# EAGLE design HIJACK_C (EAGLE 5.10)
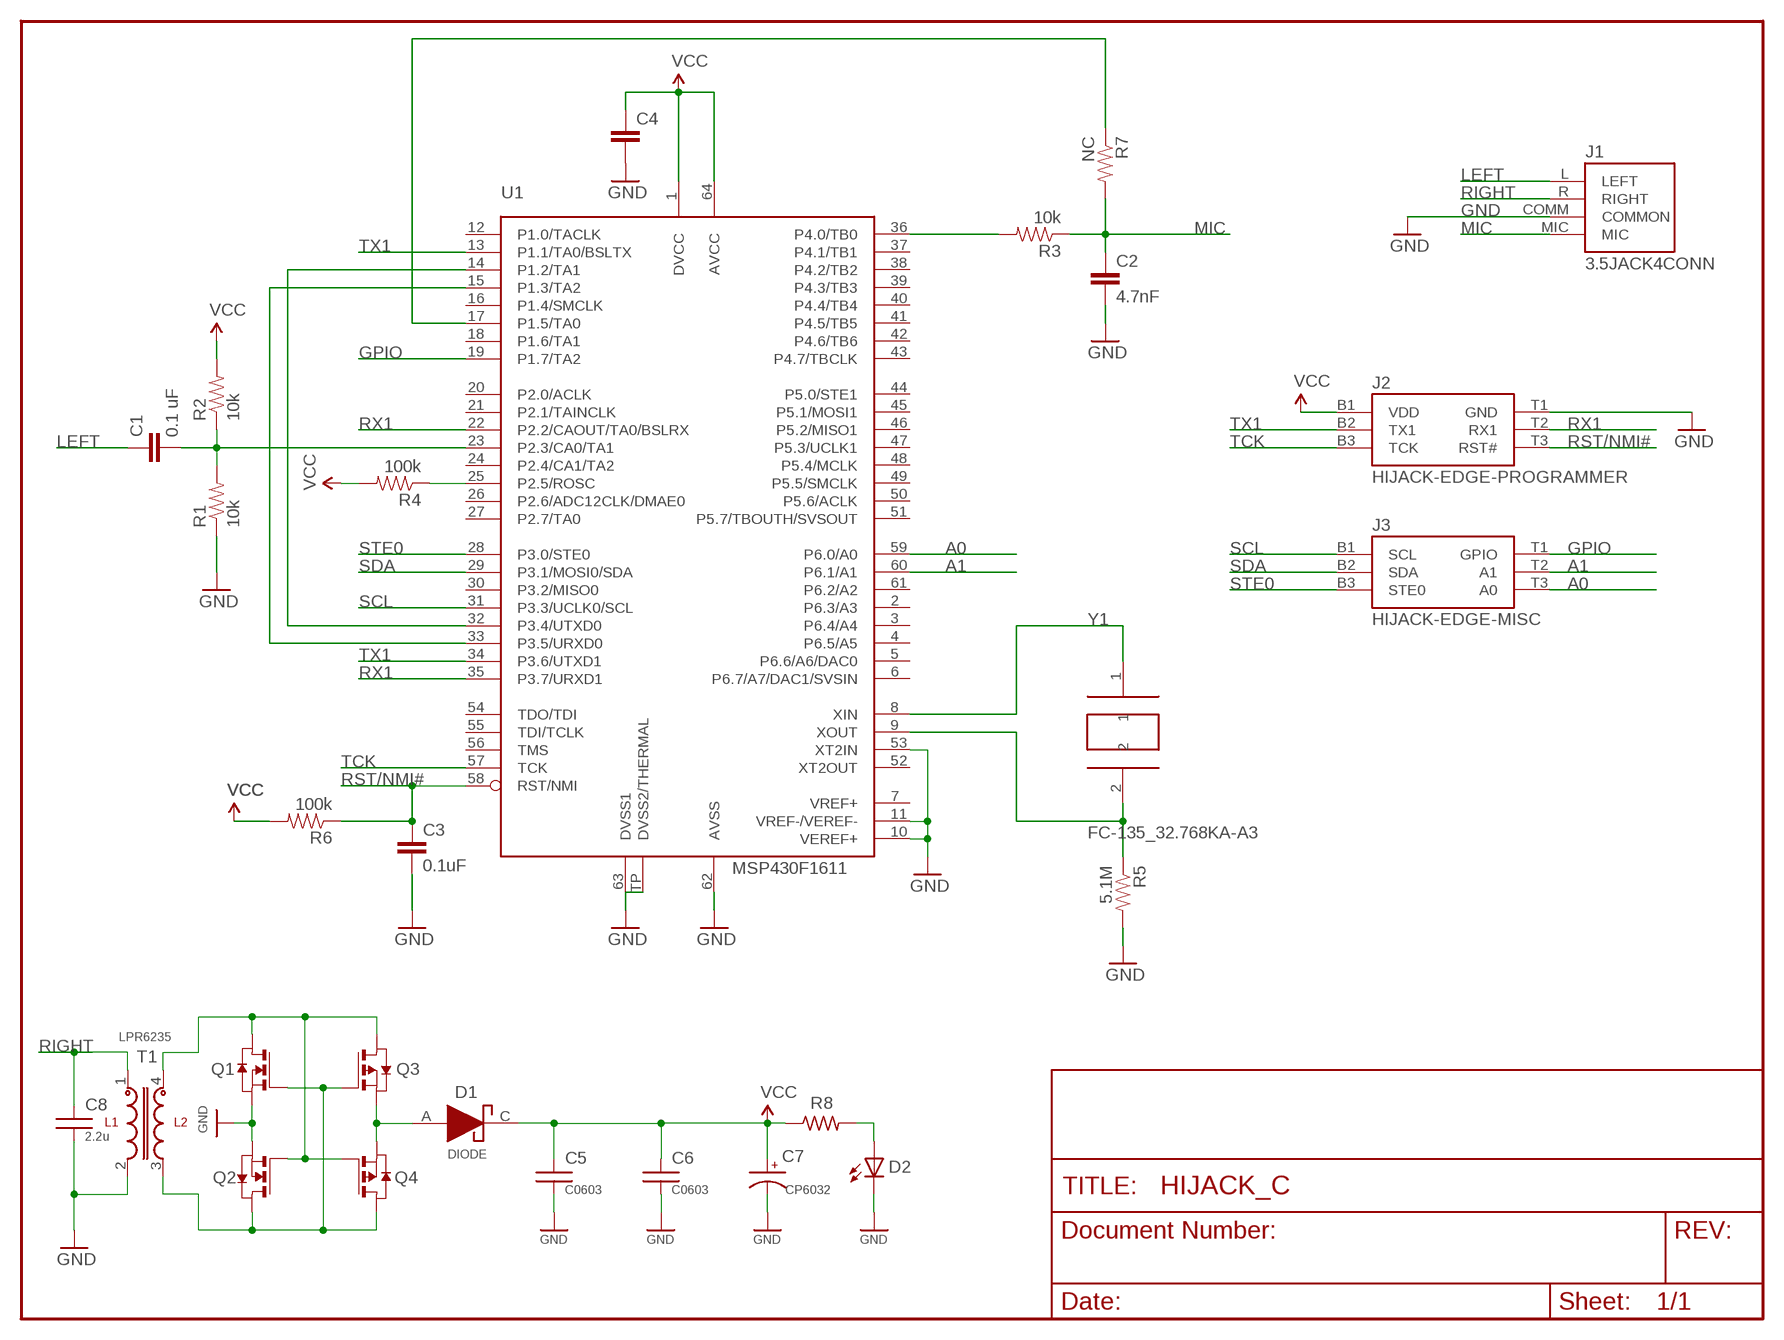
[diagram p0: schematic, sheet 1]

## Parts
C1  0.1 uF  CAP0603-CAP  [0603-CAP]
C2  4.7nF  CAP0603-CAP  [0603-CAP]
C3  0.1uF  CAP0603-CAP  [0603-CAP]
C4  CAP0603-CAP  [0603-CAP]
C5  C0603  [C0603]
C6  C0603  [C0603]
C7  CP6032  [CT6032]
C8  2.2u  C0603  [C0603]
D1  DIODE  [MINIMELF]
D2  LED0603  [LED-0603]
J1  3.5JACK4CONN  [PLUGBOARDCONNECTOR]
J2  HIJACK-EDGE-PROGRAMMER  [6-PIN-EDGE-CONNECTOR]
J3  HIJACK-EDGE-MISC  [6-PIN-EDGE-CONNECTOR]
Q1  NMOSSOT23  [SOT-23]
Q2  NMOSSOT23  [SOT-23]
Q3  PMOSSOT23  [SOT-23]
Q4  PMOSSOT23  [SOT-23]
R1  10k  RESISTOR0603-RES  [0603-RES]
R2  10k  RESISTOR0603-RES  [0603-RES]
R3  10k  RESISTOR0603-RES  [0603-RES]
R4  100k  RESISTOR0603-RES  [0603-RES]
R5  5.1M  RESISTOR0603-RES  [0603-RES]
R6  100k  RESISTOR0603-RES  [0603-RES]
R7  NC  RESISTOR0603-RES  [0603-RES]
R8  R-US_R0603  [R0603]
T1  LPR6235  [LPR6235]
U1  MSP430F1611  [RTD(S-PQFP-N64)[VQFN64]]
Y1  FC-135_32.768KA-A3  [FC-135]

## Nets
A0: J3.T3(A0) U1.59(P6.0/A0)
A1: J3.T2(A1) U1.60(P6.1/A1)
GND: C2.2 C3.2 C4.2 C5.2 C6.2 C7.- C8.2 D2.C J1.COMM(COMMON) J2.T1(GND) Q1.2(S) Q2.2(S) R1.1 R5.2 T1.2 U1.10(VEREF+) U1.11(VREF-/VEREF-) U1.53(XT2IN) U1.62(AVSS) U1.63(DVSS1) U1.TP(DVSS2/THERMAL)
GPIO: J3.T1(GPIO) U1.19(P1.7/TA2)
LEFT: C1.1 J1.L(LEFT)
MIC: C2.1 J1.MIC R3.1 R7.2
N$1: C1.2 R1.2 R2.1 U1.23(P2.3/CA0/TA1)
N$2: U1.14(P1.2/TA1) U1.32(P3.4/UTXD0)
N$3: U1.15(P1.3/TA2) U1.33(P3.5/URXD0)
N$4: R4.1 U1.25(P2.5/ROSC)
N$5: U1.8(XIN) Y1.1
N$6: R7.1 U1.17(P1.5/TA0)
N$7: R3.2 U1.36(P4.0/TB0)
N$8: Q1.1(D) Q2.3(G) Q3.1(D) Q4.3(G) T1.4
N$9: Q1.3(G) Q2.1(D) Q3.3(G) Q4.1(D) T1.3
N$10: R5.1 U1.9(XOUT) Y1.2
N$11: D2.A R8.2
N$17: D1.A Q3.2(S) Q4.2(S)
RIGHT: C8.1 J1.R(RIGHT) T1.1
RST/NMI#: C3.1 J2.T3(RST#) R6.1 U1.58(RST/NMI)
RX1: J2.T2(RX1) U1.22(P2.2/CAOUT/TA0/BSLRX) U1.35(P3.7/URXD1)
SCL: J3.B1(SCL) U1.31(P3.3/UCLK0/SCL)
SDA: J3.B2(SDA) U1.29(P3.1/MOSI0/SDA)
STE0: J3.B3(STE0) U1.28(P3.0/STE0)
TCK: J2.B3(TCK) U1.57(TCK)
TX1: J2.B2(TX1) U1.13(P1.1/TA0/BSLTX) U1.34(P3.6/UTXD1)
VCC: C4.1 C5.1 C6.1 C7.+ D1.C J2.B1(VDD) R2.2 R4.2 R6.2 R8.1 U1.1(DVCC) U1.64(AVCC)
Unconnected: U1.2(P6.3/A3) U1.3(P6.4/A4) U1.4(P6.5/A5) U1.5(P6.6/A6/DAC0) U1.6(P6.7/A7/DAC1/SVSIN) U1.7(VREF+) U1.12(P1.0/TACLK) U1.16(P1.4/SMCLK) U1.18(P1.6/TA1) U1.20(P2.0/ACLK) U1.21(P2.1/TAINCLK) U1.24(P2.4/CA1/TA2) U1.26(P2.6/ADC12CLK/DMAE0) U1.27(P2.7/TA0) U1.30(P3.2/MISO0) U1.37(P4.1/TB1) U1.38(P4.2/TB2) U1.39(P4.3/TB3) U1.40(P4.4/TB4) U1.41(P4.5/TB5) U1.42(P4.6/TB6) U1.43(P4.7/TBCLK) U1.44(P5.0/STE1) U1.45(P5.1/MOSI1) U1.46(P5.2/MISO1) U1.47(P5.3/UCLK1) U1.48(P5.4/MCLK) U1.49(P5.5/SMCLK) U1.50(P5.6/ACLK) U1.51(P5.7/TBOUTH/SVSOUT) U1.52(XT2OUT) U1.54(TDO/TDI) U1.55(TDI/TCLK) U1.56(TMS) U1.61(P6.2/A2)

## Library data of the parts
C1-C4 = SparkFun:CAP: Capacitor Standard 0603 ceramic capacitor, and 0.1" leaded capacitor.
C5 C6 C8 = umich:C
C7 = umich:CP
D1 = umich:DIODE
D2 = umich:LED: LEDs Standard schematic elements and footprints for 5mm, 3mm, 1206, and 0603 sized LEDs. 5mm - Spark Fun Electronics SKU : COM-00529 (and others)
J1 = Thomas:3.5JACK4CONN
J2 = Thomas:HIJACK-EDGE-PROGRAMMER
J3 = Thomas:HIJACK-EDGE-MISC
Q1 Q2 = zetex:NMOSSOT23: MOS FET
Q3 Q4 = zetex:PMOSSOT23: MOS FET
R1-R7 = SparkFun:RESISTOR: Resistor Basic schematic elements and footprints for 0603, 1206, and PTH 1/10th watt (small) resistors.
R8 = rcl:R-US_: RESISTOR, American symbol
T1 = umich:LPR6235
U1 = Thomas:MSP430F1611
Y1 = berkeley-epic:FC-135_32.768KA-A3

## Board
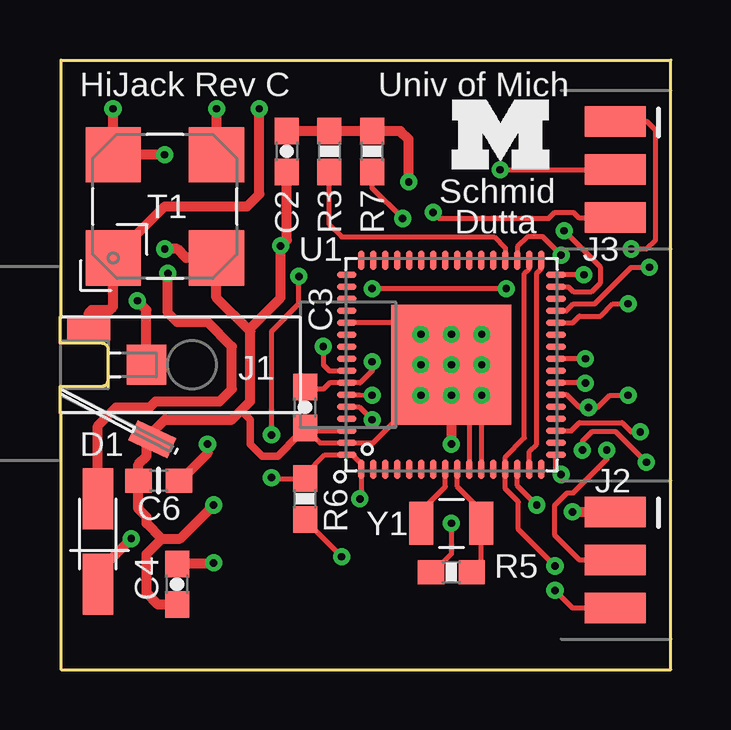
[diagram p1: board, top side]
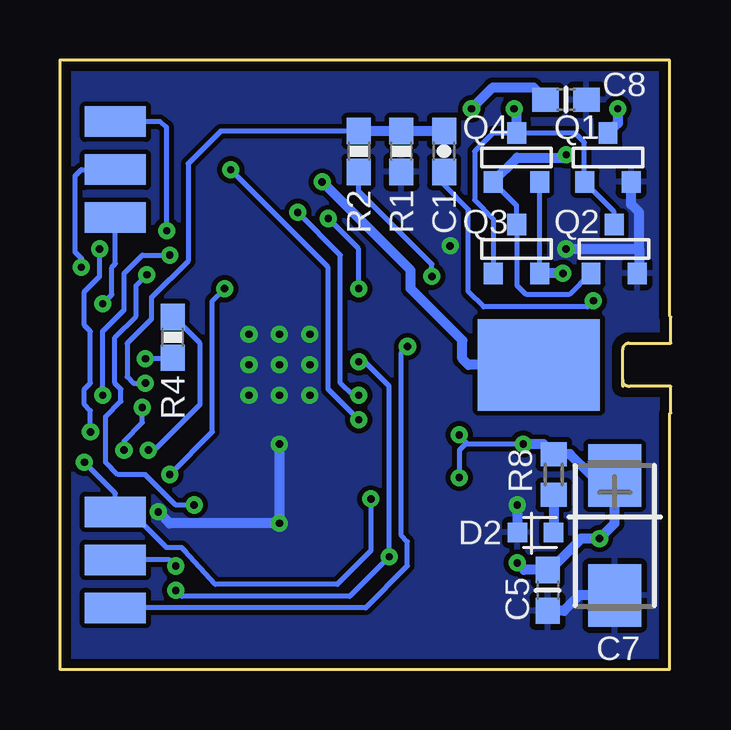
[diagram p2: board, bottom side, seen from below]

Size 25.45 x 25.4 mm. Coordinates in mm from the lower left corner, seen from the top.
Outline: 0.05,10.67 0.05,0 25.45,0 25.45,25.4 0.05,25.4 0.05,14.73
Copper layers (1*16): Top 0.035mm / dielectric 1.5mm / Bottom 0.035mm
Design rules "default *": minimum track width 8mil, minimum drill 12mil, track to track 6mil, track to pad 6mil, pad to pad 6mil, via to via 6mil, smd to smd 6mil, copper to edge 15mil, drill to drill 8mil, minimum pad ring 8mil, minimum via ring 8mil, stop-mask expansion 4mil, vias tented up to drill 15mil, thermal gap 10mil

### Footprints (pad centres in the part's own frame; a part is rotated, then mirrored left to right if it is on the bottom)
0603-CAP = smd 1.1 x 1: 1 -0.85,0; 2 0.85,0
C0603 = smd 1.1 x 1: 1 -0.85,0; 2 0.85,0
CT6032 = smd 2.6 x 2.2: + -2.5,0; - 2.5,0
MINIMELF = smd 2.54 x 1.27: A -1.778,0; C 1.778,0
LED-0603 = smd 0.8 x 0.8: A 0,-0.75; C 0,0.75
PLUGBOARDCONNECTOR = smd 1.778 x 0.914 rotated 155: COMM 3.799,-3.103 | smd 1.651 x 1.651: L 3.55,0 | smd 5.08 x 3.81 bottom: MIC 5.45,0 | smd 1.778 x 0.914: R 1.15,1.452
6-PIN-EDGE-CONNECTOR = smd 2.54 x 1.27 bottom: B1 1.5,2; B2 1.5,0; B3 1.5,-2 | smd 2.54 x 1.27: T1 1.5,2; T2 1.5,0; T3 1.5,-2
SOT-23 = smd 0.787 x 0.889: 1 0.025,-1.016; 2 -0.94,1.016; 3 0.991,1.016
0603-RES = smd 1.1 x 1: 1 -0.85,0; 2 0.85,0
R0603 = smd 1 x 1.1: 1 -0.85,0; 2 0.85,0
LPR6235 = smd 2.3 x 2.3: 1 -2.15,2.15; 2 -2.15,-2.15; 3 2.15,-2.15; 4 2.15,2.15
RTD(S-PQFP-N64)[VQFN64] = smd 0.825 x 0.28: 1 -4.36,3.75; 2 -4.36,3.25; 3 -4.36,2.75; 4 -4.36,2.25; 5 -4.36,1.75; 6 -4.36,1.25; 7 -4.36,0.75; 8 -4.36,0.25; 9 -4.36,-0.25; 10 -4.36,-0.75; 11 -4.36,-1.25; 12 -4.36,-1.75; 13 -4.36,-2.25; 14 -4.36,-2.75; 15 -4.36,-3.25; 16 -4.36,-3.75; 33 4.36,-3.75; 34 4.36,-3.25; 35 4.36,-2.75; 36 4.36,-2.25; 37 4.36,-1.75; 38 4.36,-1.25; 39 4.36,-0.75; 40 4.36,-0.25; 41 4.36,0.25; 42 4.36,0.75; 43 4.36,1.25; 44 4.36,1.75; 45 4.36,2.25; 46 4.36,2.75; 47 4.36,3.25; 48 4.36,3.75 | smd 0.28 x 0.825: 17 -3.75,-4.36; 18 -3.25,-4.36; 19 -2.75,-4.36; 20 -2.25,-4.36; 21 -1.75,-4.36; 22 -1.25,-4.36; 23 -0.75,-4.36; 24 -0.25,-4.36; 25 0.25,-4.36; 26 0.75,-4.36; 27 1.25,-4.36; 28 1.75,-4.36; 29 2.25,-4.36; 30 2.75,-4.36; 31 3.25,-4.36; 32 3.75,-4.36; 49 3.75,4.36; 50 3.25,4.36; 51 2.75,4.36; 52 2.25,4.36; 53 1.75,4.36; 54 1.25,4.36; 55 0.75,4.36; 56 0.25,4.36; 57 -0.25,4.36; 58 -0.75,4.36; 59 -1.25,4.36; 60 -1.75,4.36; 61 -2.25,4.36; 62 -2.75,4.36; 63 -3.25,4.36; 64 -3.75,4.36 | smd 5 x 5: TP 0,0
FC-135 = smd 1 x 1.8: 1 -1.25,0; 2 1.25,0

### Placement (x,y rotation side)
C1  9.45,21.59 90 bottom
C2  9.45,21.59 270 top
C3  10.21,10.92 270 top
C4  4.88,3.56 270 top
C5  5.13,3.3 270 bottom
C6  4.11,7.87 180 top
C7  2.34,5.59 270 bottom
C8  4.37,23.75 0 bottom
D1  1.57,5.33 270 top
D2  5.64,5.71 90 bottom
J1  0.05,12.7 0 top
J2  21.64,4.57 0 top
J3  21.64,20.83 0 top
Q1  2.59,21.34 180 bottom
Q2  2.34,17.53 180 bottom
Q3  6.4,17.53 180 bottom
Q4  6.4,21.34 180 bottom
R1  11.23,21.59 90 bottom
R2  13,21.59 270 bottom
R3  11.23,21.59 270 top
R4  20.75,13.84 90 bottom
R5  16.31,4.06 180 top
R6  10.21,7.11 90 top
R7  13,21.59 90 top
R8  4.88,8.13 270 bottom
T1  4.37,19.3 90 top
U1  16.31,12.7 90 top
U$1  [BLOCK-M]  16.31,20.83 0 top
Y1  16.31,6.1 0 top

### Tracks (layer width: path | path; a pad name or v marks a point on that pad's centre or on a via)
A0  (via drill 0.3)
  Top 0.203: U1.59 12.48,11.45 v13,11.43 | J3.T3 21.61,18.83 21.39,19.05 20.62,19.05 20.37,18.8 15.8,18.8 v15.54,19.05
  Bottom 0.203: v13,11.43 13.26,11.43 13.77,11.94 13.77,17.27 v15.54,19.05 15.42,19.05
A1  (via drill 0.3)
  Top 0.203: U1.60 12.47,10.95 v13,10.41 | v18.34,20.83 J3.T2
  Bottom 0.203: v13,10.41 14.27,11.68 14.27,16.76 v18.34,20.83
GND  (via drill 0.3)
  Top 0.203: U1.62 10.33,9.95 C3.2 | 8.05,14.1 7.92,14.1 7.92,14.22 | U1.53 13.99,14.45 14.02,14.48 14.27,14.22 14.78,14.22 v15.04,13.97 U1.TP | U1.10 17.06,11.95 U1.TP | U1.11 17.56,11.45 U1.TP | U1.TP v15.04,11.43 13.06,9.45 U1.63 10.83,9.45 C3.2 | R5.2 15.54,4.06 16.31,4.83 v16.31,6.1 | 7.67,10.92 7.67,10.67 | 9.96,9.78 9.83,9.69 C3.2
  Top 0.305: 7.67,10.67 7.92,10.41 7.92,9.4 8.43,8.89 9.07,8.89 9.96,9.78
  Top 0.406: 4.24,5.46 5,5.46 v6.4,6.86 | 4.24,5.46 3.61,4.83 3.61,3.17 4.08,2.71 C4.2 4.92,2.67 | v4.37,17.53 4.88,17.53 5.25,17.15 T1.2 6.52,15.5 7.92,14.1 7.92,11.18 7.67,10.92 7.16,10.41 4.37,10.41 3.85,9.89 J1.COMM 3.61,9.35 3.61,8.89 3.26,8.55 C6.2 3.26,6.69 3.61,6.35 3.61,6.1 4.24,5.46 | 7.92,14.22 9.19,15.49 v9.19,17.65 9.45,17.91 C2.2 | U1.TP v16.31,11.43 v16.31,9.4 | v21.35,6.57 J2.T1
  Bottom 0.203: 1.32,16.51 Q2.2
  Bottom 0.406: Q1.2 1.65,19.38 1.32,19.05 1.32,17.53 | 1.32,17.53 1.32,16.51 | C5.2 4.46,2.45 3.82,3.09 C7.- | Q2.2 1.4,16.59 | D2.C 6.39,6.49 v6.4,6.86 | v4.37,17.53 1.32,17.53 | v16.31,9.4 v16.31,6.1 20.88,6.1 v21.35,6.57
  other vias: 16.31,12.7 15.04,12.7 16.31,13.97 17.58,13.97 17.58,12.7 17.58,11.43
  pour Bottom (isolate 0.203): 0.56,24.64 0.56,0.51 24.94,0.51 24.94,24.89 0.56,24.89
GPIO  (via drill 0.3)
  Top 0.203: U1.19 21.3,9.95 21.64,10.29 23.42,10.29 23.8,9.91 v24.18,9.91 24.14,9.95 | J3.T1 24.47,22.83 24.82,22.48 24.82,17.91 24.43,17.53 v23.8,17.53
  Bottom 0.203: v24.18,9.91 24.18,10.79 24.43,11.05 24.43,11.68 24.18,11.94 24.18,14.1 24.43,14.35 24.43,15.75 23.8,16.38 v23.8,17.53
LEFT  (via drill 0.3)
  Top 0.406: J1.L 3.6,14.99 v3.22,15.37
  Bottom 0.203: v3.22,15.37 3.48,15.11 7.8,15.11 8.43,15.75 8.43,19.18 9.45,20.19 C1.1
MIC  (via drill 0.3)
  Top 0.406: C2.1 R3.1 R7.2 14.19,22.44 14.53,22.1 v14.53,20.32
  Bottom 0.406: J1.MIC 8.43,12.7 8.69,12.95 8.69,13.72 10.85,15.88 10.85,16.64 v14.53,20.32
N$1  (via drill 0.3)
  Top 0.203: U1.23 22.14,11.95 v21.89,11.94
  Bottom 0.203: v21.89,11.94 22.4,11.94 22.66,12.19 22.66,13.59 21.64,14.61 21.64,15.49 20.12,17.02 20.12,21.08 18.76,22.44 R2.1
  Bottom 0.406: C1.2 R1.2 R2.1
N$2  (via drill 0.3)
  Top 0.203: U1.14 19.06,7.66 v19.86,6.86 | v21.83,16.45 U1.32
  Bottom 0.203: v19.86,6.86 20.62,6.86 21.89,8.13 23.04,8.13 23.55,8.64 23.55,10.54 22.91,11.18 22.91,11.68 23.16,11.94 23.16,13.84 22.28,14.73 22.28,16 v21.83,16.45
N$3
  Top 0.203: U1.33 20.06,16.7 19.86,16.51 19.86,9.4 19.56,9.09 U1.15
N$4  (via drill 0.3)
  Top 0.203: U1.25 22.14,12.95 v21.89,12.95
  Bottom 0.203: R4.1 20.75,13.08 20.88,12.95 v21.89,12.95
N$5
  Top 0.203: U1.8 16.06,7.62 15.04,6.6 15.04,6.35 15.06,6.33 Y1.1
N$6  (via drill 0.3)
  Top 0.203: U1.17 20.67,8.34 v20.88,8.13 | R7.1 13,20.07 v14.27,18.8 | v18.59,15.88 v13,15.88
  Bottom 0.203: v20.88,8.13 19.1,9.91 19.1,15.37 v18.59,15.88 | v13,15.88 13,17.53 v14.27,18.8
N$7
  Top 0.203: U1.36 18.56,17.56 18.08,18.03 11.73,18.03 11.23,18.54 R3.2
N$8  (via drill 0.3)
  Top 0.406: v2.21,23.37 2.22,23.23 T1.4 v4.36,21.45
  Bottom 0.203: Q4.3 7.42,20.32 6.42,19.33 Q3.1 6.4,18.54 6.4,16 6.02,15.62 4.24,15.62 3.35,16.51 Q2.3
  Bottom 0.406: v2.21,23.37 2.21,22.76 Q1.1 | Q4.3 7.39,20.34 6.4,21.34 4.5,21.34 v4.36,21.45
N$9  (via drill 0.3)
  Top 0.406: T1.3 6.52,23.23 v6.53,23.37
  Bottom 0.203: 3.61,20.32 Q1.3 | Q2.1 2.36,19.07 3.61,20.32 | Q3.3 7.39,18.77 8.18,19.56 8.18,21.59 7.42,22.35 Q4.1 3.99,22.35 3.61,21.97 3.61,20.32
  Bottom 0.406: Q4.1 6.42,23.14 v6.53,23.37
N$10
  Top 0.203: U1.9 16.56,7.62 17.58,6.6 17.58,6.1 Y1.2 17.56,4.55 17.07,4.06 R5.1
N$11
  Bottom 0.406: D2.A 4.89,5.83 4.88,6.35 R8.2
N$17  (via drill 0.3)
  Top 0.406: D1.A 1.57,10.16 2.34,10.92 3.73,10.92 3.99,11.18 6.65,11.18 7.16,11.68 7.16,13.46 6.15,14.48 4.88,14.48 4.5,14.86 v4.5,16.51
  Bottom 0.203: Q3.2 Q4.2 5.46,20.37 5.38,20.45
  Bottom 0.406: v4.5,16.51 Q3.2
RIGHT  (via drill 0.3)
  Top 0.406: J1.R 1.2,14.87 1.32,14.99 2.08,14.99 2.22,15.12 T1.1 4.37,19.3 7.8,19.3 8.31,19.81 v8.31,23.37
  Bottom 0.406: v8.31,23.37 7.42,24.26 5.73,24.26 C8.1
RST/NMI#  (via drill 0.3)
  Top 0.203: 10.21,6.35 R6.1 10.21,6.22 10.34,6.22 10.34,6.1 v11.73,4.7 | C3.1 10.21,11.68 10.97,11.68 11.24,11.95 U1.58 12.51,11.95 13,12.45 v13,12.83 | 20.88,3.05 v20.62,3.3 21.35,2.57 J2.T3
  Bottom 0.203: v13,12.83 12.75,12.83 11.73,11.81 v11.73,4.7 13.39,3.05 20.37,3.05 v20.62,3.3
RX1  (via drill 0.3)
  Top 0.203: U1.22 21.11,11.45 21.64,10.92 v22.02,10.92 22.4,10.92 22.91,11.43 v23.67,11.43 | U1.35 19.06,17.61 19.48,18.03 20.12,18.03 v20.88,17.27 | J2.T2 21.64,4.57 20.62,5.59 20.62,6.86 21.13,7.37 21.39,7.37 22.78,8.76 v22.78,9.14
  Bottom 0.203: v23.67,11.43 23.67,14.1 22.78,14.99 22.78,16.51 22.02,17.27 v20.88,17.27 | v22.78,9.14 22.78,9.53 22.02,10.29 v22.02,10.92
SCL  (via drill 0.3)
  Top 0.203: U1.31 21.18,15.95 21.39,15.75 22.15,15.75 22.53,16.13 22.53,16.76 v21,18.29
  Bottom 0.203: J3.B1 21.29,22.83 21,22.61 v21,18.29
SDA  (via drill 0.3)
  Top 0.203: U1.29 21.1,14.95 21.39,15.24 22.28,15.24 23.8,16.76 v24.56,16.76
  Bottom 0.203: J3.B2 24.56,20.83 24.82,20.57 24.82,17.4 24.56,17.14 v24.56,16.76
STE0  (via drill 0.3)
  Top 0.203: U1.28 21.36,14.45 21.64,14.73 22.53,14.73 23.04,15.24 v23.67,15.24
  Bottom 0.203: J3.B3 23.14,16.91 23.29,16.76 23.29,15.62 v23.67,15.24
TCK  (via drill 0.3)
  Top 0.203: U1.57 11.22,12.45 10.97,12.7 v10.97,13.46
  Bottom 0.203: v10.97,13.46 11.23,13.21 11.23,5.59 10.97,5.33 10.97,4.32 12.72,2.57 J2.B3
TX1  (via drill 0.3)
  Top 0.203: U1.34 19.56,16.71 19.35,16.51 19.35,9.65 18.56,8.85 U1.13 18.56,7.53 19.1,6.99 19.1,5.84 v20.62,4.32
  Bottom 0.203: J2.B2 20.88,4.57 v20.62,4.32
VCC  (via drill 0.3)
  Top 0.203: v9.96,16.38 9.96,15.24 8.81,14.1 v8.81,9.78 | v12.5,7.11 12.56,7.17 U1.1 12.56,8.58 12.18,8.95 U1.64 11.03,8.95 10.21,8.13 R6.2 8.85,7.96 v8.81,8 | C4.1 C5.1 | v21.77,9.14 21.77,9.53 22.15,9.91 23.16,9.91 v24.43,8.64
  Top 0.406: C4.1 6.27,4.41 v6.4,4.45 | v2.97,5.46 1.57,4.06 D1.C | C6.1 5,7.87 6.15,9.02 v6.15,9.4
  Bottom 0.203: v9.96,16.38 9.96,16.89 13,19.94 R2.2 | 8.43,9.4 v8.81,9.78 | v6.15,9.4 8.43,9.4 | v12.5,7.11 12.5,4.95 13.89,3.56 18.97,3.56 20.24,4.95 20.37,5.08 21,5.08 22.5,6.57 J2.B1 23.14,7.34 v24.43,8.64 | 8.43,9.4 8.56,9.4 8.81,9.14 8.81,8.13 | 8.81,8.13 v8.81,8 8.94,8 8.81,8.13 | R4.2 20.71,14.69 19.61,13.59 19.61,11.05 21.51,9.14 v21.77,9.14
  Bottom 0.406: v6.15,9.4 5.3,9.4 R8.1 4.2,8.98 3.31,8.09 C7.+ 2.34,6.1 v2.97,5.46 3.73,5.46 5,4.19 C5.1 6.11,4.15 v6.4,4.45

### Text on the board
tPlace: HiJack Rev C | Univ of Mich | Schmid | Dutta